# EAGLE design ExpanderBottom (EAGLE 6.6.0)
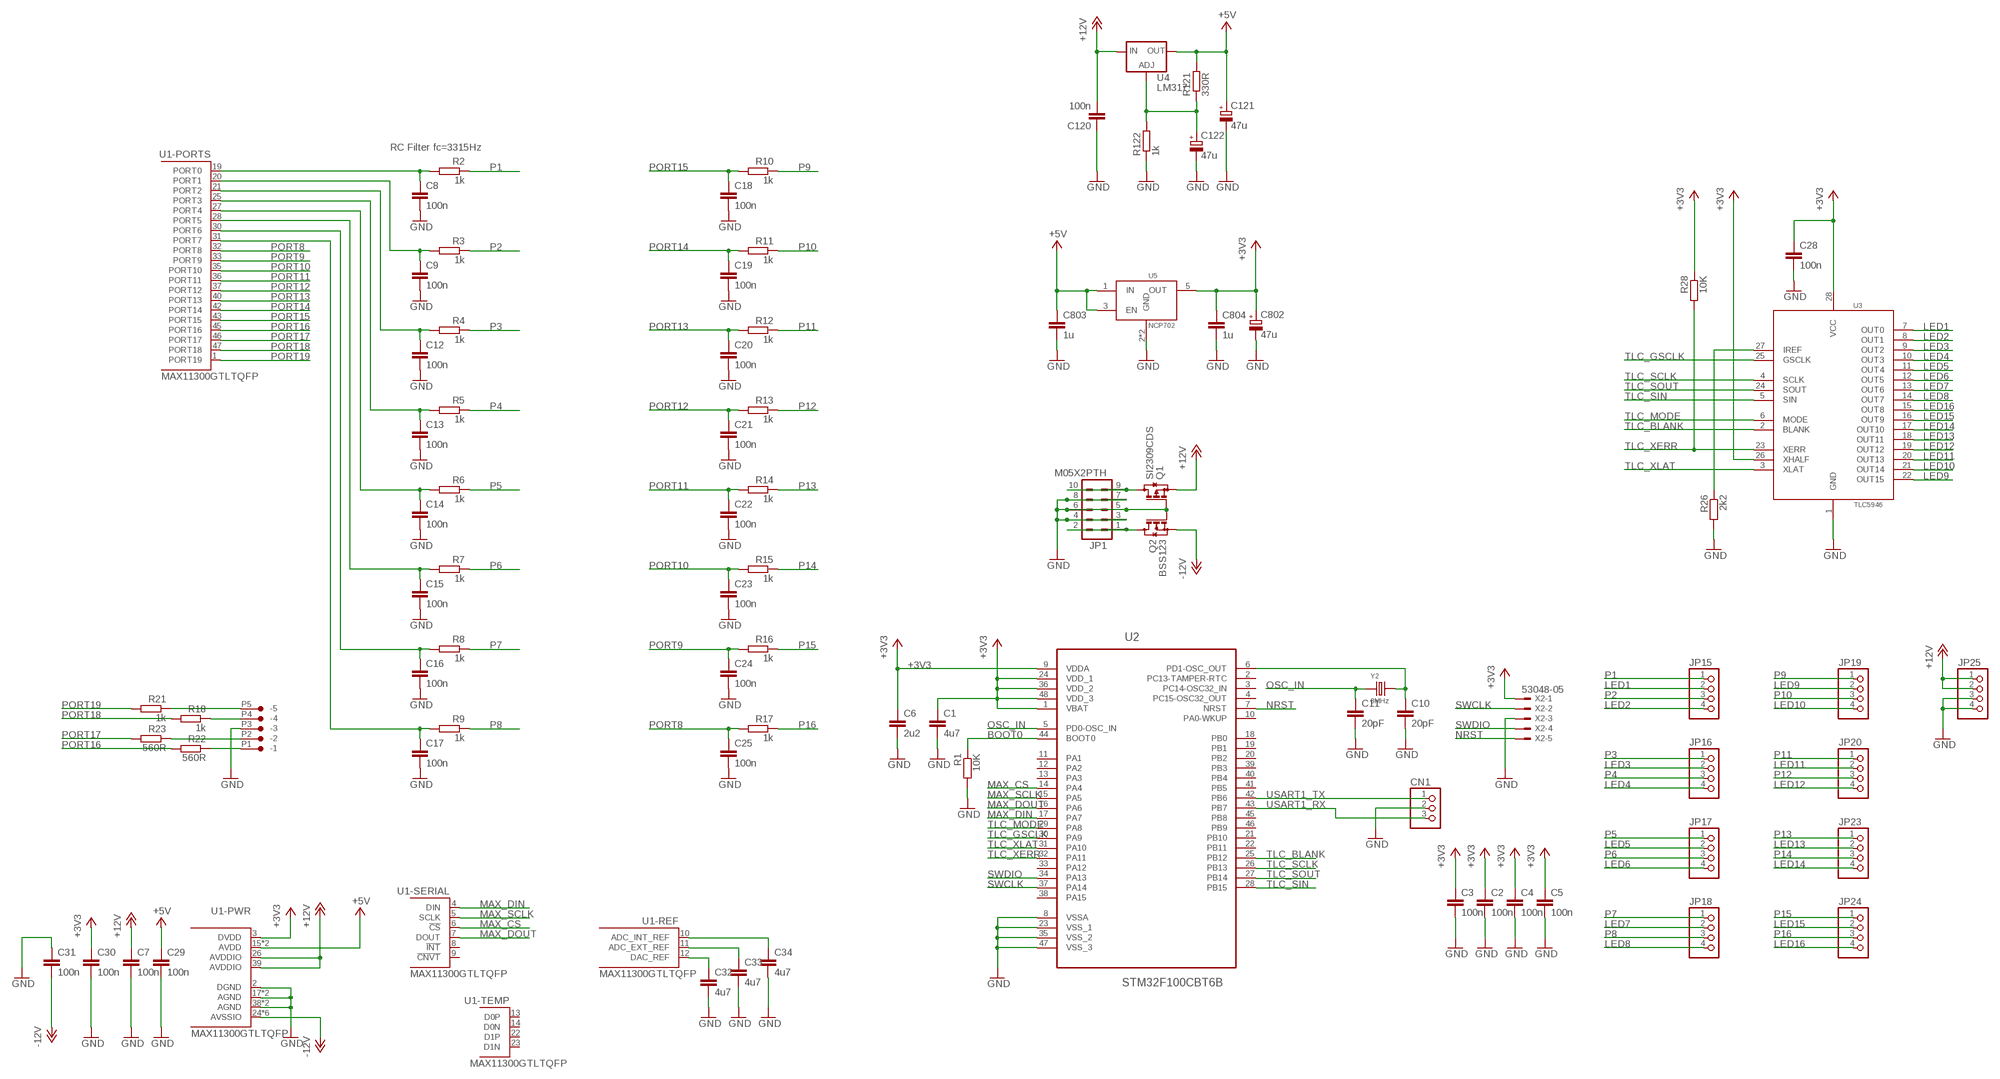
[diagram p0: schematic, sheet 1]

## Parts
5O  CON-JST_PH_5W  [CON-JST_PH_5W]
C1  4u7  C-EUC0603  [C0603]
C2  100n  C-EUC0603  [C0603]
C3  100n  C-EUC0603  [C0603]
C4  100n  C-EUC0603  [C0603]
C5  100n  C-EUC0603  [C0603]
C6  2u2  C-EUC0603  [C0603]
C7  100n  C-EUC0603  [C0603]
C8  100n  C-EUC0603  [C0603]
C9  100n  C-EUC0603  [C0603]
C10  20pF  C-EUC0603  [C0603]
C11  20pF  C-EUC0603  [C0603]
C12  100n  C-EUC0603  [C0603]
C13  100n  C-EUC0603  [C0603]
C14  100n  C-EUC0603  [C0603]
C15  100n  C-EUC0603  [C0603]
C16  100n  C-EUC0603  [C0603]
C17  100n  C-EUC0603  [C0603]
C18  100n  C-EUC0603  [C0603]
C19  100n  C-EUC0603  [C0603]
C20  100n  C-EUC0603  [C0603]
C21  100n  C-EUC0603  [C0603]
C22  100n  C-EUC0603  [C0603]
C23  100n  C-EUC0603  [C0603]
C24  100n  C-EUC0603  [C0603]
C25  100n  C-EUC0603  [C0603]
C28  100n  C-EUC0603  [C0603]
C29  100n  C-EUC0603  [C0603]
C30  100n  C-EUC0603  [C0603]
C31  100n  C-EUC0603  [C0603]
C32  4u7  C-EUC0603  [C0603]
C33  4u7  C-EUC0603  [C0603]
C34  4u7  C-EUC0603  [C0603]
C120  100n  C-EUC0603  [C0603]
C121  47u  CPOL-EU153CLV-0505  [CPOL-5]
C122  47u  CPOL-EU153CLV-0505  [CPOL-5]
C802  47u  CPOL-EU153CLV-0505  [CPOL-5]
C803  1u  C-EUC0603  [C0603]
C804  1u  C-EUC0603  [C0603]
CN1  CON-JST-1X03PH-TH  [JST-B3B-PH-KL]
JP1  M05X2PTH  [AVR_ICSP]
JP15  PINHD-1X4  [1X04]
JP16  PINHD-1X4  [1X04]
JP17  PINHD-1X4  [1X04]
JP18  PINHD-1X4  [1X04]
JP19  PINHD-1X4  [1X04]
JP20  PINHD-1X4  [1X04]
JP23  PINHD-1X4  [1X04]
JP24  PINHD-1X4  [1X04]
JP25  PINHD-1X4  [1X04]
Q1  SI2309CDS  BSS84  [SOT23]
Q2  BSS123  [SOT23]
R1  10K  R-EU_0603  [0603]
R2  1k  R-EU_0603  [0603]
R3  1k  R-EU_0603  [0603]
R4  1k  R-EU_0603  [0603]
R5  1k  R-EU_0603  [0603]
R6  1k  R-EU_0603  [0603]
R7  1k  R-EU_0603  [0603]
R8  1k  R-EU_0603  [0603]
R9  1k  R-EU_0603  [0603]
R10  1k  R-EU_0603  [0603]
R11  1k  R-EU_0603  [0603]
R12  1k  R-EU_0603  [0603]
R13  1k  R-EU_0603  [0603]
R14  1k  R-EU_0603  [0603]
R15  1k  R-EU_0603  [0603]
R16  1k  R-EU_0603  [0603]
R17  1k  R-EU_0603  [0603]
R18  1k  R-EU_0603  [0603]
R21  1k  R-EU_0603  [0603]
R22  560R  R-EU_0603  [0603]
R23  560R  R-EU_0603  [0603]
R26  2k2  R-EU_0603  [0603]
R28  10K  R-EU_0603  [0603]
R121  330R  R-EU_0603  [0603]
R122  1k  R-EU_0603  [0603]
U1  MAX11300GTLTQFP  [TQFP48]
U2  STM32F100CBT6B  [QFP50P900X900X160-48N]
U3  TLC5946  [TSSOP28]
U4  LM317  LM317MSTT3  [SOT223]
U5  NCP702  [TSOP-5]
X2  53048-05  [53048-05]
Y2  8MHz  SMD-CRYSTAL-8MHZ-20PF-20PPM(2P-5.0X3.2MM)  [X2-SMD-5.0X3.2X1.3MM]

## Nets
+3V3: C1.1 C2.1 C3.1 C4.1 C5.1 C6.1 C28.1 C30.1 C802.+ C804.1 R28.1 U1.3(-PWR:DVDD) U2.1(VBAT) U2.9(VDDA) U2.24(VDD_1) U2.36(VDD_2) U2.48(VDD_3) U3.26(XHALF) U3.28(VCC) U5.5(OUT) X2.1
+5V: C29.1 C121.+ C803.1 R121.2 U1.15(-PWR:AVDD) U1.16(-PWR:AVDD) U4.2(OUT) U4.4(OUT) U5.1(IN) U5.3(EN)
+12V: C7.1 C120.2 JP25.1 JP25.2 Q1.2(S) U1.26(-PWR:AVDDIO) U1.39(-PWR:AVDDIO) U4.3(IN)
-12V: C31.2 Q2.2(S) U1.24(-PWR:AVSSIO) U1.29(-PWR:AVSSIO) U1.34(-PWR:AVSSIO) U1.41(-PWR:AVSSIO) U1.44(-PWR:AVSSIO) U1.48(-PWR:AVSSIO)
BOOT0: R1.1 U2.44(BOOT0)
GND: 5O.P3(-3) C1.2 C2.2 C3.2 C4.2 C5.2 C6.2 C7.2 C8.2 C9.2 C10.2 C11.2 C12.2 C13.2 C14.2 C15.2 C16.2 C17.2 C18.2 C19.2 C20.2 C21.2 C22.2 C23.2 C24.2 C25.2 C28.2 C29.2 C30.2 C31.1 C32.2 C33.2 C34.2 C120.1 C121.- C122.- C802.- C803.2 C804.2 CN1.2 JP1.3 JP1.4 JP1.5 JP1.6 JP1.7 JP1.8 JP25.3 JP25.4 Q1.1(G) Q2.1(G) R1.2 R26.2 R122.1 U1.2(-PWR:DGND) U1.17(-PWR:AGND) U1.18(-PWR:AGND) U1.38(-PWR:AGND) U1.EP(-PWR:AGND) U2.8(VSSA) U2.23(VSS_1) U2.35(VSS_2) U2.47(VSS_3) U3.1(GND) U5.2(GND) U5.4(GND) X2.3
LED1: JP15.2 U3.7(OUT0)
LED2: JP15.4 U3.8(OUT1)
LED3: JP16.2 U3.9(OUT2)
LED4: JP16.4 U3.10(OUT3)
LED5: JP17.2 U3.11(OUT4)
LED6: JP17.4 U3.12(OUT5)
LED7: JP18.2 U3.13(OUT6)
LED8: JP18.4 U3.14(OUT7)
LED9: JP19.2 U3.22(OUT15)
LED10: JP19.4 U3.21(OUT14)
LED11: JP20.2 U3.20(OUT13)
LED12: JP20.4 U3.19(OUT12)
LED13: JP23.2 U3.18(OUT11)
LED14: JP23.4 U3.17(OUT10)
LED15: JP24.2 U3.16(OUT9)
LED16: JP24.4 U3.15(OUT8)
MAX_CS: U1.6(-SERIAL:!CS!) U2.14(PA4)
MAX_DIN: U1.4(-SERIAL:DIN) U2.17(PA7)
MAX_DOUT: U1.7(-SERIAL:DOUT) U2.16(PA6)
MAX_SCLK: U1.5(-SERIAL:SCLK) U2.15(PA5)
N$1: C10.1 U2.6(PD1-OSC_OUT) Y2.2
N$2: C34.1 U1.10(-REF:ADC_INT_REF)
N$3: 5O.P2(-2) R23.1
N$4: C33.1 U1.11(-REF:ADC_EXT_REF)
N$5: C32.1 U1.12(-REF:DAC_REF)
N$7: 5O.P1(-1) R22.1
N$8: 5O.P4(-4) R18.1
N$9: 5O.P5(-5) R21.1
N$11: JP1.1 JP1.2 Q2.3(D)
N$12: JP1.9 JP1.10 Q1.3(D)
N$16: C122.+ R121.1 R122.2 U4.1(ADJ)
N$43: R26.1 U3.27(IREF)
NRST: U2.7(NRST) X2.5
OSC_IN: C11.1 U2.5(PD0-OSC_IN) Y2.1
P1: JP15.1 R2.1
P2: JP15.3 R3.1
P3: JP16.1 R4.1
P4: JP16.3 R5.1
P5: JP17.1 R6.1
P6: JP17.3 R7.1
P7: JP18.1 R8.1
P8: JP18.3 R9.1
P9: JP19.1 R10.1
P10: JP19.3 R11.1
P11: JP20.1 R12.1
P12: JP20.3 R13.1
P13: JP23.1 R14.1
P14: JP23.3 R15.1
P15: JP24.1 R16.1
P16: JP24.3 R17.1
PORT0: C8.1 R2.2 U1.19(-PORTS:PORT0)
PORT1: C9.1 R3.2 U1.20(-PORTS:PORT1)
PORT2: C12.1 R4.2 U1.21(-PORTS:PORT2)
PORT3: C13.1 R5.2 U1.25(-PORTS:PORT3)
PORT4: C14.1 R6.2 U1.27(-PORTS:PORT4)
PORT5: C15.1 R7.2 U1.28(-PORTS:PORT5)
PORT6: C16.1 R8.2 U1.30(-PORTS:PORT6)
PORT7: C17.1 R9.2 U1.31(-PORTS:PORT7)
PORT8: C25.1 R17.2 U1.32(-PORTS:PORT8)
PORT9: C24.1 R16.2 U1.33(-PORTS:PORT9)
PORT10: C23.1 R15.2 U1.35(-PORTS:PORT10)
PORT11: C22.1 R14.2 U1.36(-PORTS:PORT11)
PORT12: C21.1 R13.2 U1.37(-PORTS:PORT12)
PORT13: C20.1 R12.2 U1.40(-PORTS:PORT13)
PORT14: C19.1 R11.2 U1.42(-PORTS:PORT14)
PORT15: C18.1 R10.2 U1.43(-PORTS:PORT15)
PORT16: R22.2 U1.45(-PORTS:PORT16)
PORT17: R23.2 U1.46(-PORTS:PORT17)
PORT18: R18.2 U1.47(-PORTS:PORT18)
PORT19: R21.2 U1.1(-PORTS:PORT19)
SWCLK: U2.37(PA14) X2.2
SWDIO: U2.34(PA13) X2.4
TLC_BLANK: U2.25(PB12) U3.2(BLANK)
TLC_GSCLK: U2.30(PA9) U3.25(GSCLK)
TLC_MODE: U2.29(PA8) U3.6(MODE)
TLC_SCLK: U2.26(PB13) U3.4(SCLK)
TLC_SIN: U2.28(PB15) U3.5(SIN)
TLC_SOUT: U2.27(PB14) U3.24(SOUT)
TLC_XERR: R28.2 U2.32(PA11) U3.23(XERR)
TLC_XLAT: U2.31(PA10) U3.3(XLAT)
USART1_RX: CN1.3 U2.43(PB7)
USART1_TX: CN1.1 U2.42(PB6)
Unconnected: U1.8(-SERIAL:!INT!) U1.9(-SERIAL:!CNVT!) U1.13(-TEMP:D0P) U1.14(-TEMP:D0N) U1.22(-TEMP:D1P) U1.23(-TEMP:D1N) U2.2(PC13-TAMPER-RTC) U2.3(PC14-OSC32_IN) U2.4(PC15-OSC32_OUT) U2.10(PA0-WKUP) U2.11(PA1) U2.12(PA2) U2.13(PA3) U2.18(PB0) U2.19(PB1) U2.20(PB2) U2.21(PB10) U2.22(PB11) U2.33(PA12) U2.38(PA15) U2.39(PB3) U2.40(PB4) U2.41(PB5) U2.45(PB8) U2.46(PB9)

## Notes on the sheet
- RC Filter fc=3315Hz

## Library data of the parts
5O = Rebel:CON-JST_PH_5W
C1-C25 C28-C34 C120 C803 C804 = Rebel:C-EU: CAPACITOR, European symbol
C121 C122 C802 = Rebel:CPOL-EU: POLARIZED CAPACITOR, European symbol
CN1 = Rebel:CON-JST-1X03
JP1 = SparkFun:M05X2: Header 5x2 Standard 10-pin dual row 0.1" header. Commonly used with AVR-ISP. Use with Spark Fun Electronics SKU: PRT-00778
JP15-JP20 JP23-JP25 = pinhead:PINHD-1X4: PIN HEADER
Q1 = transistor-small-signal:BSS84: P-CHANNEL MOS FET; OC_FARNELL: 1779264
Q2 = transistor-small-signal:BSS123: N-CHANNEL MOS FET; OC_FARNELL: 1843725
R1-R18 R21-R23 R26 R28 R121 R122 = Rebel:R-EU_: RESISTOR, European symbol
U1 = Rebel:MAX11300GTL: 12 BIT ADC / DAC
U2 = Rebel:STM32F100CBT6B: ARM-based 32-bit MCU; MPN: STM32F100CBT6B; OC_FARNELL: 1838512; OC_NEWARK: 86R1308; PACKAGE: LQFP-48; SUPPLIER: STMircroelectronics
U3 = Rebel:TLC5946
U4 = v-reg:LM317?*: 500 mA Adjustable Output Positive Voltage Regulator Source: http://www.onsemi.co.jp .. LM317M-D.PDF
U5 = Rebel:NCP702
X2 = con-molex:53?-05: CONNECTOR wire to board 1.25 mm (.049 inch) pitch header; MF: MOLEX; MPN: 53048-0510; OC_FARNELL: 9732926; OC_NEWARK: 57H4722
Y2 = Seeed-OPL-crystal-osctllator:SMD-CRYSTAL-8MHZ-20PF-20PPM(2P-5.0X3.2MM): 306010004; MPN: 5032/2P; VALUE: 5032/2p

## Board
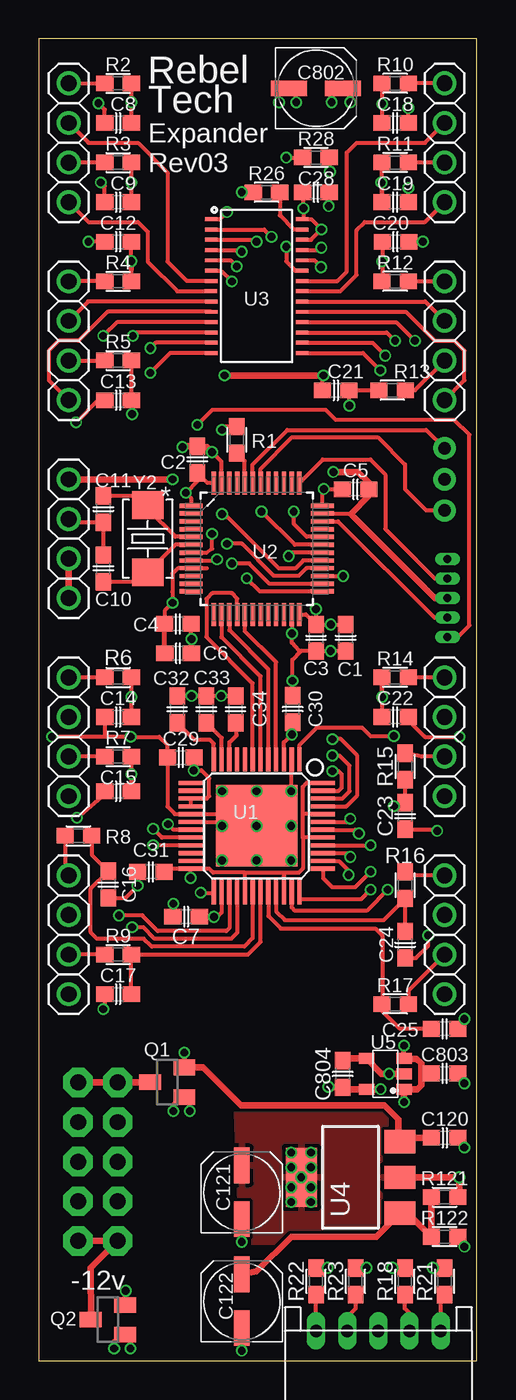
[diagram p1: board, top side]
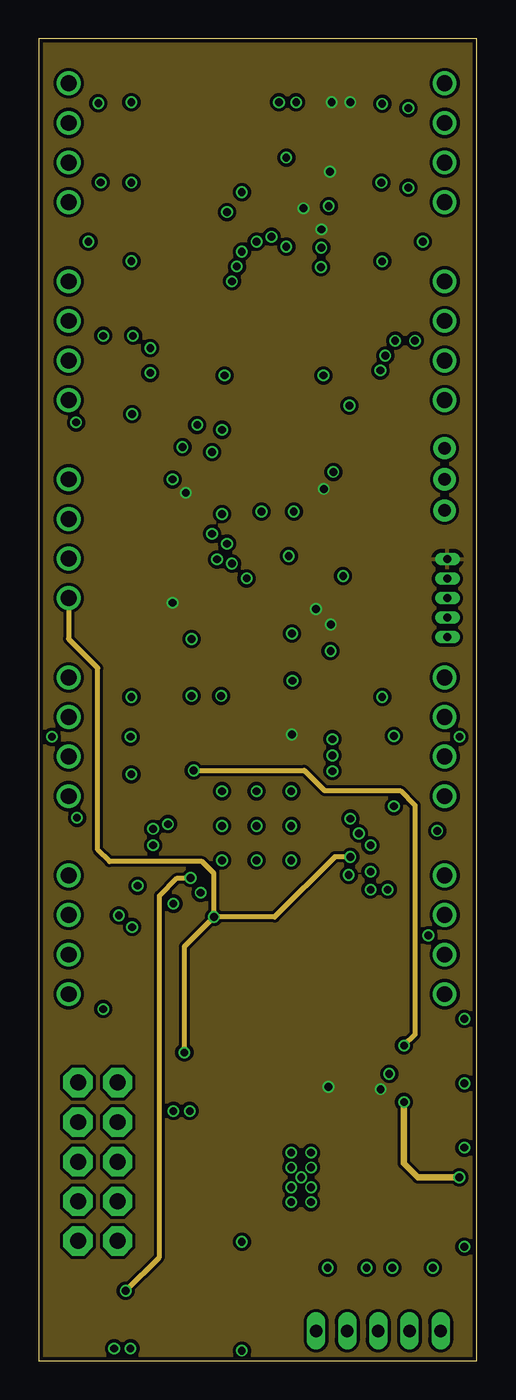
[diagram p2: board, inner layer Route2]
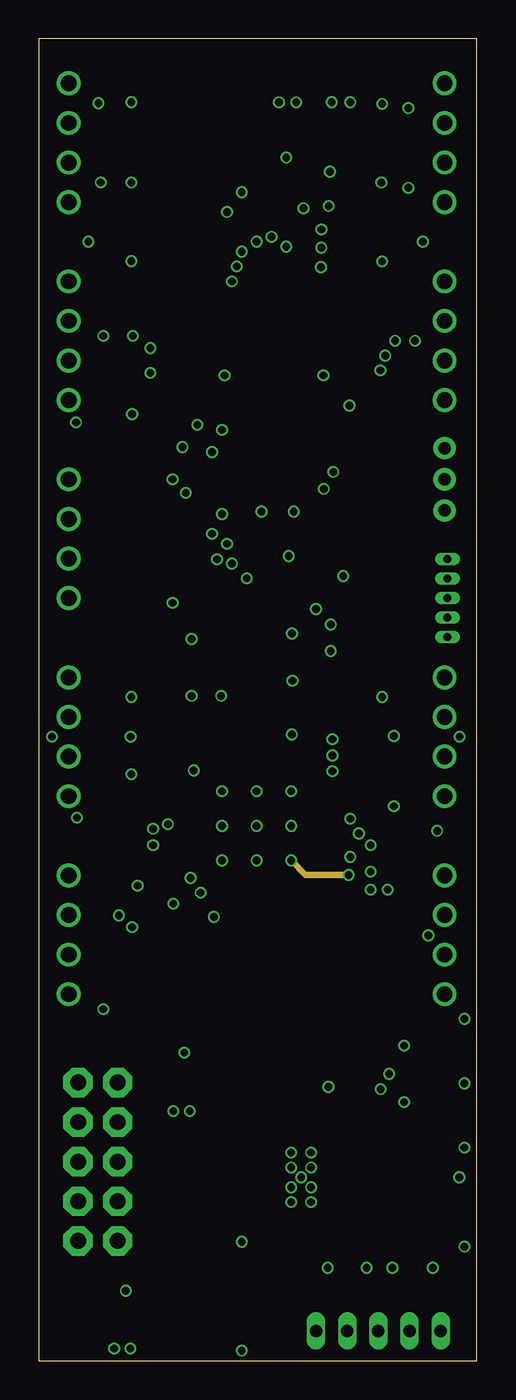
[diagram p3: board, inner layer Route15]
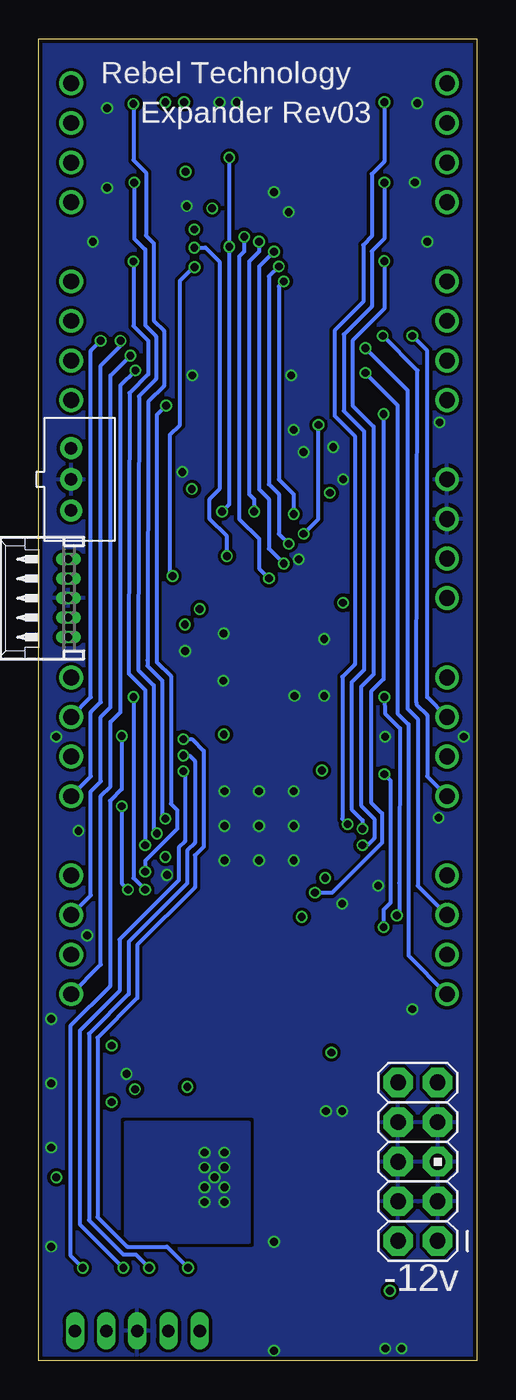
[diagram p4: board, bottom side, seen from below]

Size 28.09 x 84.76 mm. Coordinates in mm from the lower left corner, seen from the top.
Outline: 0,84.76 0,0 28.09,0 28.09,84.76 0,84.76
Copper layers (1*2*15*16): Top 0.035mm / dielectric 0.2mm / Route2 0.0175mm / dielectric 0.3mm / Route15 0.0175mm / dielectric 0.2mm / Bottom 0.035mm
Design rules "SeeedStudio_4layer_DRU_no_angle_20140221": minimum track width 8mil, minimum drill 12mil, track to track 8mil, track to pad 8mil, pad to pad 8mil, via to via 8mil, smd to smd 0mil, copper to edge 10mil, drill to drill 8mil, minimum pad ring 6mil, minimum via ring 4mil, stop-mask expansion 4mil, vias tented up to drill 25mil, thermal gap 10mil

### Footprints (pad centres in the part's own frame; a part is rotated, then mirrored left to right if it is on the bottom)
CON-JST_PH_5W = drill 0.8 long: P1 0,0; P2 -2,0; P3 -4,0; P4 -6,0; P5 -8,0
C0603 = smd 1.1 x 1: 1 -0.85,0; 2 0.85,0
CPOL-5 = smd 2.3 x 1: + 1.725,0; - -1.725,0
JST-B3B-PH-KL = drill 0.8 pad 1.422: 1 2,0; 2 0,0; 3 -2,0
AVR_ICSP = drill 1.016 pad 1.88 octagon: 1 -1.27,5.08; 2 1.27,5.08; 3 -1.27,2.54; 4 1.27,2.54; 5 -1.27,0; 6 1.27,0; 7 -1.27,-2.54; 8 1.27,-2.54; 9 -1.27,-5.08; 10 1.27,-5.08
1X04 = drill 1.016: 1 -3.81,0; 2 -1.27,0; 3 1.27,0; 4 3.81,0
SOT23 = smd 1 x 1.4: 1 -0.95,-1.1; 2 0.95,-1.1; 3 0,1.1
0603 = smd 1.1 x 1: 1 -0.85,0; 2 0.85,0
TQFP48 = smd 0.27 x 1.55: 1 -2.75,-4.25; 2 -2.25,-4.25; 3 -1.75,-4.25; 4 -1.25,-4.25; 5 -0.75,-4.25; 6 -0.25,-4.25; 7 0.25,-4.25; 8 0.75,-4.25; 9 1.25,-4.25; 10 1.75,-4.25; 11 2.25,-4.25; 12 2.75,-4.25; 25 2.75,4.25; 26 2.25,4.25; 27 1.75,4.25; 28 1.25,4.25; 29 0.75,4.25; 30 0.25,4.25; 31 -0.25,4.25; 32 -0.75,4.25; 33 -1.25,4.25; 34 -1.75,4.25; 35 -2.25,4.25; 36 -2.75,4.25 | smd 1.55 x 0.27: 13 4.25,-2.75; 14 4.25,-2.25; 15 4.25,-1.75; 16 4.25,-1.25; 17 4.25,-0.75; 18 4.25,-0.25; 19 4.25,0.25; 20 4.25,0.75; 21 4.25,1.25; 22 4.25,1.75; 23 4.25,2.25; 24 4.25,2.75; 37 -4.25,2.75; 38 -4.25,2.25; 39 -4.25,1.75; 40 -4.25,1.25; 41 -4.25,0.75; 43 -4.25,-0.25; 44 -4.25,-0.75; 45 -4.25,-1.25; 46 -4.25,-1.75; 47 -4.25,-2.25; 48 -4.25,-2.75 | smd 1.5 x 0.3: 42 -4.25,0.25 | smd 5.22 x 5.22: EP 0,0
QFP50P900X900X160-48N = smd 1.473 x 0.279: 1 -4.216,2.743; 2 -4.216,2.261; 3 -4.216,1.753; 4 -4.216,1.245; 5 -4.216,0.762; 6 -4.216,0.254; 7 -4.216,-0.254; 8 -4.216,-0.762; 9 -4.216,-1.245; 10 -4.216,-1.753; 11 -4.216,-2.261; 12 -4.216,-2.743; 25 4.216,-2.743; 26 4.216,-2.261; 27 4.216,-1.753; 28 4.216,-1.245; 29 4.216,-0.762; 30 4.216,-0.254; 31 4.216,0.254; 32 4.216,0.762; 33 4.216,1.245; 34 4.216,1.753; 35 4.216,2.261; 36 4.216,2.743 | smd 0.279 x 1.473: 13 -2.743,-4.216; 14 -2.261,-4.216; 15 -1.753,-4.216; 16 -1.245,-4.216; 17 -0.762,-4.216; 18 -0.254,-4.216; 19 0.254,-4.216; 20 0.762,-4.216; 21 1.245,-4.216; 22 1.753,-4.216; 23 2.261,-4.216; 24 2.743,-4.216; 37 2.743,4.216; 38 2.261,4.216; 39 1.753,4.216; 40 1.245,4.216; 41 0.762,4.216; 42 0.254,4.216; 43 -0.254,4.216; 44 -0.762,4.216; 45 -1.245,4.216; 46 -1.753,4.216; 47 -2.261,4.216; 48 -2.743,4.216
TSSOP28 = smd 0.8 x 0.25: 1 -2.921,4.623; 2 -2.921,3.962; 3 -2.921,3.302; 4 -2.921,2.642; 5 -2.921,1.981; 6 -2.921,1.321; 7 -2.921,0.66; 8 -2.927,0; 9 -2.921,-0.66; 10 -2.921,-1.321; 11 -2.921,-1.981; 12 -2.921,-2.642; 13 -2.921,-3.302; 14 -2.921,-3.962; 15 2.921,-3.962; 16 2.921,-3.302; 17 2.921,-2.642; 18 2.921,-1.981; 19 2.921,-1.321; 20 2.921,-0.66; 21 2.927,0; 22 2.921,0.66; 23 2.921,1.321; 24 2.921,1.981; 25 2.921,2.642; 26 2.921,3.302; 27 2.921,3.962; 28 2.921,4.623
SOT223 = smd 1.5 x 2: 1 -2.3,-3.15; 2 0,-3.15; 3 2.3,-3.15 | smd 3.8 x 2: 4 0,3.15
TSOP-5 = smd 0.7 x 1: 1 -0.99,-1.2; 2 0,-1.2; 3 0.99,-1.2; 4 0.99,1.2; 5 -0.99,1.2
53048-05 = drill 0.5 pad 0.698 long: 1 2.5,-1.25; 2 1.25,-1.25; 3 0,-1.25; 4 -1.25,-1.25; 5 -2.5,-1.25
X2-SMD-5.0X3.2X1.3MM = smd 1.778 x 2.032: 1 -2.159,0; 2 2.159,0

### Placement (x,y rotation side)
5O  17.78,1.91 180 top
C1  19.68,46.35 270 top
C2  10.16,57.78 90 top
C3  17.78,46.35 270 top
C4  8.92,47.24 0 top
C5  20.32,55.88 0 top
C6  8.93,45.36 0 top
C7  9.44,28.46 180 top
C8  5.08,79.38 180 top
C9  5.08,74.3 180 top
C10  4.13,50.8 90 top
C11  4.13,54.61 270 top
C12  5.08,71.75 180 top
C13  5.08,61.59 180 top
C14  5.08,41.27 180 top
C15  5.08,36.51 180 top
C16  4.45,30.53 270 top
C17  5.08,23.5 180 top
C18  22.86,79.38 0 top
C19  22.86,74.3 0 top
C20  22.88,71.75 0 top
C21  19.05,62.23 180 top
C22  22.86,41.27 0 top
C23  23.49,34.92 270 top
C24  23.49,26.67 270 top
C25  26.03,21.27 0 top
C28  17.78,74.93 0 top
C29  9.1,38.67 180 top
C30  16.28,41.78 90 top
C31  7.19,31.34 0 top
C32  8.87,41.76 90 top
C33  10.74,41.76 90 top
C34  12.62,41.76 90 top
C120  26.03,14.29 180 top
C121  13.02,10.79 90 top
C122  13.02,3.81 90 top
C802  17.78,81.6 0 top
C803  26.03,18.41 0 top
C804  19.5,18.38 90 top
CN1  26.03,56.52 270 bottom
JP1  3.78,12.75 180 bottom
JP15  1.9,78.11 270 top
JP16  1.9,65.41 270 top
JP17  1.9,40.01 270 top
JP18  1.9,27.3 270 top
JP19  26.03,78.11 270 top
JP20  26.03,65.41 270 top
JP23  26.03,40.01 270 top
JP24  26.03,27.3 270 top
JP25  1.9,52.7 90 top
Q1  8.23,17.85 90 top
Q2  4.42,2.62 90 top
R1  12.7,59.05 90 top
R2  5.08,81.92 0 top
R3  5.08,76.83 0 top
R4  5.08,69.22 0 top
R5  5.08,64.14 0 top
R6  5.08,43.81 0 top
R7  5.08,38.73 0 top
R8  2.54,33.66 0 top
R9  5.08,26.04 0 top
R10  22.86,81.92 180 top
R11  22.86,76.83 180 top
R12  22.86,69.22 180 top
R13  22.67,62.23 180 top
R14  22.86,43.81 180 top
R15  23.49,38.1 270 top
R16  23.49,30.48 270 top
R17  22.86,22.86 180 top
R18  23.49,5.08 90 top
R21  26.03,5.08 90 top
R22  17.78,5.08 90 top
R23  20.32,5.08 90 top
R26  14.6,74.93 180 top
R28  17.78,77.15 180 top
R121  26.03,10.48 0 top
R122  26.03,7.94 180 top
U1  13.97,34.29 180 top
U2  13.97,52.07 0 top
U3  13.97,68.58 0 top
U4  20,11.75 90 top
U5  22.22,18.38 90 top
X2  27.46,48.9 90 bottom
Y2  6.98,52.7 270 top

### Tracks (layer width: path | path; a pad name or v marks a point on that pad's centre or on a via)
+3V3  (via drill 0.5)
  Top 0.254: U2.48 10.81,56.29 C2.1 10.16,56.38 v9.43,55.65 9.75,55.33 U2.1 | 10.77,50.83 U2.9 8.91,50.83 8.57,50.48 8.57,49.29 v8.58,48.6 8.07,48.09 C4.1 | U3.26 17.46,71.88 v18.13,72.55 17.48,73.2 U3.28 16.98,73.29 v16.98,73.9 16.98,74.88 C28.1 | v19.98,80.7 19.98,81.12 C802.+ | v18.78,80.7 18.78,81.7 | v18.68,76.25 18.68,77.1 R28.1 | U1.3 15.72,39.64 v16.23,40.15 16.23,40.88 C30.1 | U2.36 18.19,55.81 v18.28,55.9 19.45,55.9 C5.1 | U2.24 17.13,47.85 C3.1 C1.1 v18.73,47.2 | v17.78,48.2 17.78,47.3
  Top 0.305: C6.1 C4.1
  Top 0.406: R28.1 18.63,77.05 | U5.5 19.64,17.39 C804.1 18.6,17.53 v18.58,17.55 | v21.93,17.4 21.08,17.4
  pour Route2 (rank 2): -0.64,85.72 28.57,85.72 28.57,-1.91 -0.64,-1.91 -0.64,84.45
+5V  (via drill 0.5)
  Top 0.254: U1.16 U1.15 10.77,36.04 10.93,36.2 10.93,37.35 10.43,37.85 v9.93,37.85 9.95,37.87 C29.1 9.95,38.33
  Top 0.305: U5.3 v23.42,20.2
  Top 0.406: 12.84,13.02 C121.+ | 16.51,13.02 16.83,12.7 16.83,11.77 U4.4 | R121.2 26.99,10.58 26.99,10.79 v26.98,11.75 | U4.2 22.86,11.77 23.84,11.77 24.13,11.77 24.45,11.75 v26.98,11.75 | v23.43,16.57 v23.42,16.58 U5.1 24.27,17.39 24.53,17.65 24.53,18.45 | v26.98,11.75 | 24.53,18.45 24.53,19.05 24.23,19.35 23.45,19.35 U5.3 | v23.42,20.2 v23.43,20.2 | C803.1 24.56,18.41 24.53,18.45
  Route2 0.305: v9.93,37.85 17.03,37.85 18.33,36.55 23.18,36.55 24.13,35.6 24.13,20.9 v23.43,20.2
  Route2 0.406: v26.98,11.75 24.33,11.75 23.43,12.65 v23.43,16.57 23.43,15.95
  other vias: 16.19,13.34 17.46,13.34 17.46,11.11 16.19,11.11 16.19,10.16 17.46,10.16 16.19,12.38 17.46,12.38 16.83,11.75
  pour Top: 12.7,15.88 13.02,7.62 22.22,7.62 22.22,15.88
  pour Bottom: 14.6,15.24 22.54,15.24 22.54,7.62 14.6,7.62
+12V  (via drill 0.5)
  Top 0.254: U1.39 19.74,32.54 v19.98,32.3 | U1.26 11.72,28.74 11.43,28.45 v11.23,28.45 10.31,28.45 C7.1
  Top 0.305: Q1.2 v9.33,19.75
  Top 0.406: JP25.2 JP25.1 | C120.2 23.39,14.29 U4.3 23.07,13.97 23.07,15.46 22.18,16.35 12.98,16.35 10.53,18.8 Q1.2
  Route2 0.305: v9.33,19.75 9.33,26.55 v11.23,28.45 | v19.98,32.3 18.98,32.3 15.13,28.45 v11.23,28.45 | v11.23,28.45 11.23,31.25 10.48,32 4.53,32 3.78,32.75 3.78,44.4 1.9,46.27 JP25.1
-12V  (via drill 0.5)
  Top 0.254: U1.24 8.04,31.54 C31.2 | v9.73,30.95 U1.24 | U1.29 13.22,31.09 13.23,31.3 | 13.23,31.3 15.73,31.3 | 15.73,31.3 15.72,31.06 U1.34 | 13.23,31.3 11.18,31.3 10.93,31.55 U1.24 | 9.48,31.55 U1.24 | U1.24 | U1.41 16.94,33.54 16.93,33.55 | 16.93,33.55 16.93,35 | 16.93,35 16.93,36.8 17.18,37.05 U1.48 | U1.44 16.97,35.04 16.93,35 | 16.93,33.55 16.93,31.55 16.68,31.3 15.73,31.3
  Top 0.305: Q2.2 5.52,4.42 v5.57,4.47
  Route2 0.305: v5.57,4.47 7.73,6.63 7.73,29.8 8.88,30.95 v9.73,30.95
BOOT0
  Top 0.254: U2.44 13.21,57.7 R1.1
GND  (via drill 0.5)
  Top 0.254: 4.23,41.49 C14.2 4,41.27 | 14.22,34.54 U1.EP | 14.72,35.04 U1.EP | v16.19,32.07 U1.EP | 11.72,32.04 U1.EP | 4.45,29.51 C16.2 5.56,29.68 v6.33,30.45 6.33,31.33 C31.1 | C17.2 4.23,22.64 v4.13,22.54 | C15.2 4.23,36.3 v2.44,34.81 | 4.28,40.01 v0.83,40.01 | U3.1 11.61,73.2 v12.06,73.66 | C9.2 4.23,75.35 v3.97,75.56 | C8.2 4.23,80.22 v3.81,80.64 | C12.2 v3.17,71.75 | C25.2 27.2,21.49 v27.3,21.91 | C10.2 C11.2 2.12,53.76 JP25.3 | U2.23 16.23,46.71 v16.24,46.62 16.23,46.66 16.23,46.05 16.72,45.51 16.83,45.51 | U2.47 11.71,57.66 v11.11,58.26 | R1.2 11.96,59.91 v11.75,59.69 | U2.8 11.3,51.31 v11.43,51.38 | C22.2 23.71,41.06 24.76,40.01 v26.99,40.01 | C19.2 23.71,75.16 v23.71,75.22 | C18.2 23.71,80.22 v23.71,80.33 | C20.2 v24.63,71.75 | 18.63,74.72 v18.6,74.05 | C21.2 18.2,63.13 | U2.35 20.04,54.33 | C13.2 3.81,61.59 v2.38,60.17 | C23.2 25.46,34.08 v25.56,33.97 | v15.4,80.7 15.4,81.42 15.48,81.5 15.96,81.5 C802.- | v16.19,36.51 16.19,38.51 U1.2 | C6.2 9.78,46.39 | 9.78,46.39 C4.2 | C34.2 C33.2 | C33.2 C32.2 | v9.79,42.63 10.73,42.63 C33.2 | v11.69,42.63 12.65,42.63 12.68,42.6 | U1.18 11.5,34.54 v11.75,34.29 11.68,34.36 11.68,35.1 11.62,35.04 U1.17 8.73,35.05 8.25,35.53 C29.2 8.23,38.7 8.23,39.5 7.72,40.01 v5.88,40.01 4.28,40.01 | 16.22,32.04 v16.19,32.07 | v16.19,32.07 v13.97,32.07 | C30.2 16.28,43.59 v16.27,43.6 16.27,44.94 16.83,45.51 | C1.2 v18.72,45.51 v18.72,45.5 v18.71,45.51 C3.2 16.83,45.51 | 16.48,81.6 16.48,80.7 v16.5,80.7 | 9.78,46.39 9.79,46.37 v9.79,46.28 | 3.81,41.27 4,41.27 | 4,41.27 4.23,41.05 4.23,40.05 4.28,40.01 | C24.2 24.2,25.82 24.98,26.6 24.98,27.15 v24.99,27.27 | U1.38 19.24,32.04 19.88,31.4 v19.88,31.15
  Top 0.254: C7.2 8.59,29.09 v8.63,29.3
  Top 0.305: v9.68,16 9.68,16.55 Q1.1 8.98,16.55 8.78,16.55 8.63,16.4 v8.63,16 | v5.87,0.77 5.87,1.32 Q2.1 5.22,1.37 4.97,1.37 4.82,1.22 v4.82,0.77
  Top 0.406: JP25.4 v8.57,56.52 | R26.2 v13.02,74.93 | C28.2 18.63,74.72 | v18.89,56.99 20.48,56.99 21.17,56.3 C5.2 21.17,55.46 20.04,54.33 20.04,54.25 25.4,48.9 X2.3 | C2.2 9.26,58.63 v9.21,58.58 | v11.11,58.26 10.79,58.58 10.32,58.58 10.16,58.42 | v11.91,63.18 18.14,63.18 18.2,63.13 | U5.2 v22.47,18.38 21.98,18.37 U5.4 19.64,19.37 C804.2 | C803.2 26.88,18.2 v27.3,17.78 | C121.- v13.02,7.62 | C122.- v13.02,0.64 | C120.1 26.88,14.07 v27.3,13.65 | R122.1 26.88,7.72 v27.3,7.3
  Route15 0.406: v19.88,31.15 17.11,31.15 v16.19,32.07 16.17,32.09
  other vias: 13.97,34.29 11.75,32.07 11.75,36.51 13.97,36.51 16.19,34.29 18.26,63.18
  pour Bottom (rank 2): 0,86.36 29.21,86.36 29.21,-1.27 0,-1.27 0,85.09
LED1
  Top 0.254: U3.7 9.5,69.24 8.25,70.48 8.25,76.2 6.35,78.11 3.17,78.11 JP15.2
LED2
  Top 0.254: U3.8 8.89,68.58 6.98,70.48 6.98,72.39 6.35,73.03 3.17,73.03 JP15.4
LED3
  Top 0.254: JP16.2 3.15,67.92 U3.9
LED4
  Top 0.254: U3.10 4.39,67.26 2.54,65.41 1.27,65.41 0.63,64.77 0.63,62.87 JP16.4
LED5  (via drill 0.5)
  Top 0.254: U3.11 5,66.6 v4.13,65.72
  Bottom 0.254: JP17.2 3.17,42.55 3.17,64.77 v4.13,65.72
LED6  (via drill 0.5)
  Top 0.254: U3.12 6.25,65.94 v6.03,65.72
  Bottom 0.254: v6.03,65.72 3.81,63.5 3.86,42.2 3.86,42.08 3.18,41.4 3.18,37.47 JP17.4
LED7  (via drill 0.5)
  Top 0.254: U3.13 7.49,65.28 v7.14,64.93
  Bottom 0.254: v7.14,64.93 4.45,62.23 4.45,41.81 3.78,41.15 3.78,30.45 JP18.2
LED8  (via drill 0.5)
  Top 0.254: U3.14 8.42,64.62 v7.14,63.34
  Bottom 0.254: JP18.4 4.38,25.97 4.38,40.8 5.08,41.5 5.08,61.28 v7.14,63.34
LED9
  Top 0.254: U3.22 19.14,69.24 19.75,69.85 19.75,77.47 20.39,78.11 24.76,78.11 JP19.2
LED10
  Top 0.254: U3.21 19.33,68.58 20.38,69.62 20.38,72.49 20.91,73.03 24.76,73.03 JP19.4
LED11
  Top 0.254: U3.20 24.79,67.92 JP20.2
LED12
  Top 0.254: JP20.4 27.3,62.87 27.3,64.77 26.67,65.41 25.4,65.41 23.55,67.26 U3.19
LED13  (via drill 0.5)
  Top 0.254: v24.13,65.41 22.94,66.6 U3.18
  Bottom 0.254: JP23.2 24.76,42.55 24.76,64.77 v24.13,65.41
LED14  (via drill 0.5)
  Top 0.254: U3.17 22.33,65.94 v22.86,65.41
  Bottom 0.254: JP23.4 24.76,37.47 24.76,41.59 24.13,42.23 24.13,63.82 22.86,65.09 v22.86,65.41
LED15  (via drill 0.5)
  Top 0.254: U3.16 21.4,65.28 v22.22,64.45
  Bottom 0.254: JP24.2 24.76,29.84 24.76,36.51 24.13,37.15 24.13,41.27 23.49,41.91 23.49,63.18 v22.22,64.45
LED16  (via drill 0.5)
  Top 0.254: U3.15 20.79,64.62 v21.91,63.5
  Bottom 0.254: JP24.4 24.13,25.4 24.13,36.2 23.49,36.83 23.49,40.96 22.86,41.59 22.86,62.55 v21.91,63.5
MAX_CS
  Top 0.254: U2.14 11.71,46.39 14.22,43.88 U1.6
MAX_DIN
  Top 0.254: U2.17 13.21,46.8 15.22,44.79 U1.4
MAX_DOUT
  Top 0.254: U2.16 12.72,48.87 12.38,49.21 11.11,49.21 10.74,48.84 10.74,46.41 13.72,43.43 U1.7
MAX_SCLK
  Top 0.254: U2.15 12.22,46.84 14.72,44.34 U1.5
N$1
  Top 0.254: C10.1 6.39,49.95 Y2.2 8.76,52.32 U2.6
N$2
  Top 0.254: U1.10 12.22,39.64 12.68,40.1 12.68,40.85 C34.1
N$3
  Top 0.254: 5O.P2 19.78,2.8 20.33,3.35 R23.1
N$4
  Top 0.254: U1.11 11.72,39.94 C33.1
N$5
  Top 0.254: U1.12 11.22,39.56 10.98,39.8 9.98,39.8 C32.1
N$7
  Top 0.254: 5O.P1 R22.1
N$8
  Top 0.254: 5O.P4 23.78,3.05 23.48,3.35 23.48,4.21 R18.1
N$9
  Top 0.254: 5O.P5 25.78,3.98 R21.1
N$11
  Top 0.406: JP1.1 JP1.2 3.32,5.94 3.35,2.59 Q2.3
N$12
  Top 0.406: JP1.9 JP1.10 7.11,17.83 Q1.3
N$16
  Top 0.406: R121.1 R122.2 23.67,9.45 U4.1 21.64,7.94 16.19,7.94 13.97,5.71 C122.+
N$43
  Top 0.254: U3.27 16.36,72.54 15.45,73.44 R26.1
NRST  (via drill 0.5)
  Top 0.254: U2.7 10.73,51.82 11.11,52.07 v11.11,53.02 | v10.16,60.01 11.11,60.96 18.41,60.96 19.05,60.33 26.67,60.33 27.62,59.37 27.62,47.15 26.87,46.4 X2.5
  Bottom 0.254: v11.11,53.02 10.16,53.98 v10.16,60.01
OSC_IN
  Top 0.254: C11.1 6.39,55.46 Y2.1 6.98,54.61 8.76,52.83 U2.5
P1
  Top 0.254: JP15.1 R2.1
P2
  Top 0.254: R3.1 JP15.3
P3
  Top 0.254: R4.1 JP16.1
P4
  Top 0.254: JP16.3 R5.1
P5
  Top 0.254: R6.1 JP17.1
P6
  Top 0.254: R7.1 JP17.3
P7
  Top 0.254: R8.1 1.69,31.33 JP18.1
P8
  Top 0.254: R9.1 JP18.3
P9
  Top 0.254: JP19.1 R10.1
P10
  Top 0.254: JP19.3 R11.1
P11
  Top 0.254: R12.1 JP20.1
P12
  Top 0.254: JP20.3 24.13,62.23 R13.1
P13
  Top 0.254: JP23.1 R14.1
P14
  Top 0.254: JP23.3 24.55,38.73 R15.1
P15
  Top 0.254: JP24.1 23.71,31.11 R16.1
P16
  Top 0.254: JP24.3 23.71,23.71 R17.1
PORT0  (via drill 0.5)
  Top 0.254: R2.2 v5.93,80.7 C8.1 | U1.19 8.64,34.04 v8.28,34.4
  Bottom 0.254: v5.93,80.7 5.93,76.9 6.73,76.1 6.73,72.1 7.28,71.55 7.28,67.9 9.13,66.05 9.13,60.6 7.83,59.3 7.83,44.65 8.63,43.85 8.63,34.75 v8.28,34.4
PORT1  (via drill 0.5)
  Top 0.254: R3.2 v5.93,75.55 C9.1 | U1.20 7.89,33.54 v7.33,34.1
  Bottom 0.254: v5.93,75.55 5.93,71.95 6.73,71.15 6.73,67.6 8.53,65.8 8.53,60.9 7.23,59.6 7.23,44.3 8.03,43.5 8.03,35.35 7.33,34.65 v7.33,34.1
PORT2  (via drill 0.5)
  Top 0.254: C12.1 R4.2 v5.93,70.52 | U1.21 8.42,33.04 v7.33,33.05
  Bottom 0.254: v5.93,70.52 5.93,67.45 7.94,65.45 7.94,61.21 6.63,59.9 6.63,44 7.43,43.2 7.43,35.6 6.58,34.75 6.58,33.5 7.03,33.05 v7.33,33.05
PORT3  (via drill 0.5)
  Top 0.254: R5.2 C13.1 5.98,61.55 v5.98,60.7 | v10.38,30 11.18,30 U1.25
  Bottom 0.254: v5.98,60.7 5.98,43.7 6.78,42.9 6.78,35.8 6.08,35.1 6.08,33.2 9.28,30 v10.38,30
PORT4  (via drill 0.5)
  Top 0.254: R6.2 v5.93,42.55 C14.1 6.35,41.27 | U1.27 12.22,27.74 12.03,27.55 7.63,27.55 6.63,28.55 v5.13,28.55
  Bottom 0.254: v5.93,42.55 5.88,41.5 4.93,40.55 4.98,30.6 4.98,28.65 v5.13,28.55
PORT5  (via drill 0.5)
  Top 0.254: 6.35,36.51 C15.1 v5.93,37.6 R7.2 | U1.28 12.72,27.44 12.33,27.05 7.43,27.05 6.68,27.8 v5.98,27.8
  Bottom 0.254: v5.93,37.6 5.53,37.2 5.53,29.35 5.98,28.9 v5.98,27.8
PORT6
  Top 0.254: R8.2 3.39,32.44 C16.1 3.33,30.27 3.33,27.45 3.73,27.05 6.73,27.05 7.23,26.55 13.18,26.55 13.72,27.09 U1.30
PORT7
  Top 0.254: 5.71,26.45 R9.2 | C17.1 R9.2 | R9.2 13.41,26.04 14.23,26.85 U1.31
PORT8
  Top 0.254: C25.1 23.18,21.27 22.01,22.44 R17.2 22.03,22.88 22.03,27.25 21.58,27.7 15.53,27.7 14.72,28.51 U1.32
PORT9
  Top 0.254: C24.1 R16.2 23.46,29.6 23.48,29.6 22.13,28.25 15.78,28.25 15.22,28.81 U1.33
PORT10  (via drill 0.5)
  Top 0.254: C23.1 23.18,35.56 | R15.2 C23.1 | v22.78,35.55 23.27,35.55 C23.1 | v22.38,30.2 21.03,28.85 16.43,28.85 16.23,29.05 U1.35
  Bottom 0.254: v22.78,35.55 22.78,30.6 v22.38,30.2
PORT11  (via drill 0.5)
  Top 0.254: C22.1 R14.2 22.01,42.57 v22.03,42.55 | 16.73,30.65 U1.36 16.73,29.6 20.68,29.6 v21.28,30.2
  Bottom 0.254: v22.03,42.55 22.03,30.95 v21.28,30.2
PORT12  (via drill 0.5)
  Top 0.254: R13.2 C21.1 19.93,62.2 v19.93,61.25 | v21.28,31.35 20.28,30.35 18.83,30.35 18.24,30.94 18.24,31.54 U1.37
  Bottom 0.254: v19.93,61.25 20.53,60.65 20.53,44.8 19.63,43.9 19.63,35.7 19.23,35.3 19.23,34.1 21.28,32.05 v21.28,31.35
PORT13  (via drill 0.5)
  Top 0.254: 21.91,69.43 21.8,69.43 | R12.2 22.01,69.33 | 21.91,69.43 21.91,69.53 | C20.1 v22.03,70.5 22.03,69.23 R12.2 | 21.91,69.43 21.91,69.32 R12.2 | U1.40 v21.27,33.04 v21.28,33.05
  Bottom 0.254: v22.03,70.5 22.03,66.35 21.08,65.4 21.08,63.25 22.28,62.05 22.33,44.9 22.33,44.05 21.28,43 v21.28,33.05
PORT14  (via drill 0.5)
  Top 0.254: R11.2 C19.1 22.01,75.52 v21.98,75.55 | U1.42 20.29,34.04 v20.53,33.8
  Bottom 0.254: v21.98,75.55 21.98,71.95 21.28,71.25 21.28,66.4 20.58,65.7 20.58,62.95 21.68,61.85 21.73,44.9 21.73,44.3 20.73,43.3 20.73,34 v20.53,33.8
PORT15  (via drill 0.5)
  Top 0.254: R10.2 C18.1 22.01,80.58 arc-90 v22.03,80.6 | U1.43 19.77,34.54 v19.98,34.75
  Bottom 0.254: v22.03,80.6 22.03,77 21.23,76.2 21.23,72.15 20.73,71.65 20.73,66.7 20.08,66.05 20.08,62.5 21.08,61.5 21.13,44.9 21.13,44.55 20.18,43.6 20.18,34.95 v19.98,34.75
PORT16  (via drill 0.5)
  Top 0.254: U1.45 19.72,35.54 20.43,36.25 20.43,38.8 19.38,39.85 v18.83,39.85 | R22.2 18.51,5.93 v18.53,5.95
  Bottom 0.254: v18.83,39.85 18.28,39.85 17.53,39.1 17.53,32.95 18.08,32.4 18.08,30.35 21.78,26.65 21.78,23.25 24.33,20.7 24.33,9.2 22.43,7.3 19.88,7.3 v18.53,5.95
PORT17  (via drill 0.5)
  Top 0.254: U1.46 19.47,36.04 19.93,36.5 19.93,38.15 19.28,38.8 v18.83,38.8 | v21.03,5.95 20.34,5.95 R23.2
  Bottom 0.254: v18.83,38.8 18.43,38.8 18.08,38.45 18.08,33.2 18.58,32.7 18.58,30.6 22.33,26.85 22.33,23.5 24.88,20.95 24.88,9 22.68,6.8 21.88,6.8 v21.03,5.95
PORT18  (via drill 0.5)
  Top 0.254: U1.47 19.22,36.54 19.43,36.75 19.43,37.6 19.23,37.8 v18.83,37.8 | v22.68,5.95 23.47,5.95 arc-90 R18.2
  Bottom 0.254: v18.83,37.8 18.73,37.7 18.73,33.3 19.13,32.9 19.13,30.8 22.93,27 22.93,23.7 25.48,21.15 25.48,8.75 v22.68,5.95
PORT19  (via drill 0.5)
  Top 0.254: U1.1 16.72,39.49 17.83,40.6 20.73,40.6 21.28,40.05 v22.78,40.05 22.68,39.95 | v25.28,5.95 26.01,5.95 R21.2
  Bottom 0.254: v22.78,40.05 22.78,36.65 23.53,35.9 23.53,24 26.08,21.45 26.08,6.75 v25.28,5.95
SWCLK
  Top 0.254: 16.71,56.4 U2.37 18.21,57.78 21.27,57.78 22.22,56.83 22.22,53.34 25.42,50.15 X2.2
SWDIO
  Top 0.254: U2.34 19.2,53.82 25.38,47.65 X2.4
TLC_BLANK  (via drill 0.5)
  Top 0.254: U3.2 14.45,72.54 v14.92,72.07 | U2.25 14.17,49.33 v13.33,50.16
  Bottom 0.254: v14.92,72.07 14.92,71.12 15.24,70.8 15.24,53.98 13.97,52.7 13.97,50.8 v13.33,50.16
TLC_GSCLK  (via drill 0.5)
  Top 0.254: U2.30 16.26,51.82 v16.03,51.59 | U3.25 17.96,71.22 v18.12,71.38
  Bottom 0.254: v16.03,51.59 16.03,52.86 17.14,53.98 17.14,55.24 16.51,55.88 16.51,70.48 17.4,71.38 v18.12,71.38
TLC_MODE  (via drill 0.5)
  Top 0.254: U3.6 11.7,69.9 v12.38,69.22 | v11.75,54.29 11.91,54.29 15.4,50.8 16.46,50.8 16.97,51.31 U2.29
  Bottom 0.254: v12.38,69.22 12.7,68.9 12.7,56.52 11.75,55.56 v11.75,54.29
TLC_SCLK  (via drill 0.5)
  Top 0.254: U3.4 12.92,71.22 v13.02,71.12 | U2.26 14.8,49.81 13.49,51.12 v12.38,51.12
  Bottom 0.254: v13.02,71.12 13.97,70.17 13.97,55.88 13.33,55.24 13.33,52.07 v12.38,51.12
TLC_SIN  (via drill 0.5)
  Top 0.254: U3.5 12.31,70.56 v12.7,70.17 | U2.28 17.17,50.83 16.67,50.32 15.08,50.32 13.02,52.39 v12.06,52.39
  Bottom 0.254: v12.7,70.17 13.33,69.53 13.33,56.2 12.7,55.56 12.7,53.02 v12.06,52.39
TLC_SOUT  (via drill 0.5)
  Top 0.254: U2.27 v19.52,50.32 | U3.24 17.68,70.56 v18.1,70.13
  Bottom 0.254: v19.52,50.32 19.68,50.48 19.68,59.37 19.05,60.01 19.05,69.25 18.15,70.15 v18.1,70.13
TLC_XERR  (via drill 0.5)
  Top 0.254: v16.35,54.45 16.35,53.66 17.18,52.83 U2.32 | v15.88,71.44 15.88,70.48 16.46,69.9 U3.23 | v15.88,77.15 R28.2
  Bottom 0.254: v16.35,54.45 15.88,54.93 v15.88,71.44 v15.88,77.15
TLC_XLAT  (via drill 0.5)
  Top 0.254: U3.3 13.84,71.88 v13.97,71.75 | v14.29,54.45 16.41,52.32 U2.31
  Bottom 0.254: v13.97,71.75 13.97,71.12 14.6,70.48 14.6,55.56 14.29,55.24 v14.29,54.45
USART1_RX
  Top 0.254: U2.43 13.72,57.47 15.93,59.69 24.86,59.69 CN1.3
USART1_TX
  Top 0.254: U2.42 14.22,57.19 16.25,59.21 21.75,59.21 23.49,57.47 23.49,55.88 24.86,54.52 CN1.1

### Text on the board
tPlace: Rebel | Tech | Expander | Rev03 | -12v
bPlace: Rebel Technology | Expander Rev03 | -12v